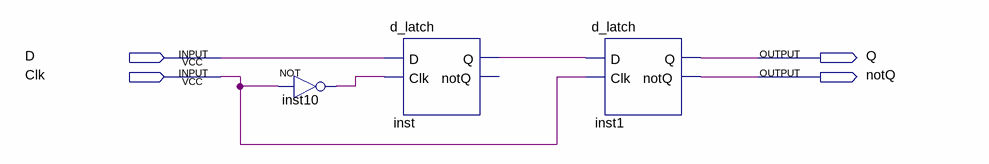
[diagram p0: schematic sheet]
// Quartus schematic ms_ff.bdf as structural Verilog: 3 symbols, 4 pins
module ms_ff (
  input  D,
  input  Clk,
  output Q,
  output notQ
);

  wire inst10_out, inst_q;

  not inst10 (inst10_out, Clk);
  d_latch inst (.D(D), .Clk(inst10_out), .Q(inst_q));  // open: notQ
  d_latch inst1 (.D(inst_q), .Clk(Clk), .Q(Q), .notQ(notQ));
endmodule
